# EAGLE design ID-12_breakout (EAGLE 5.11)
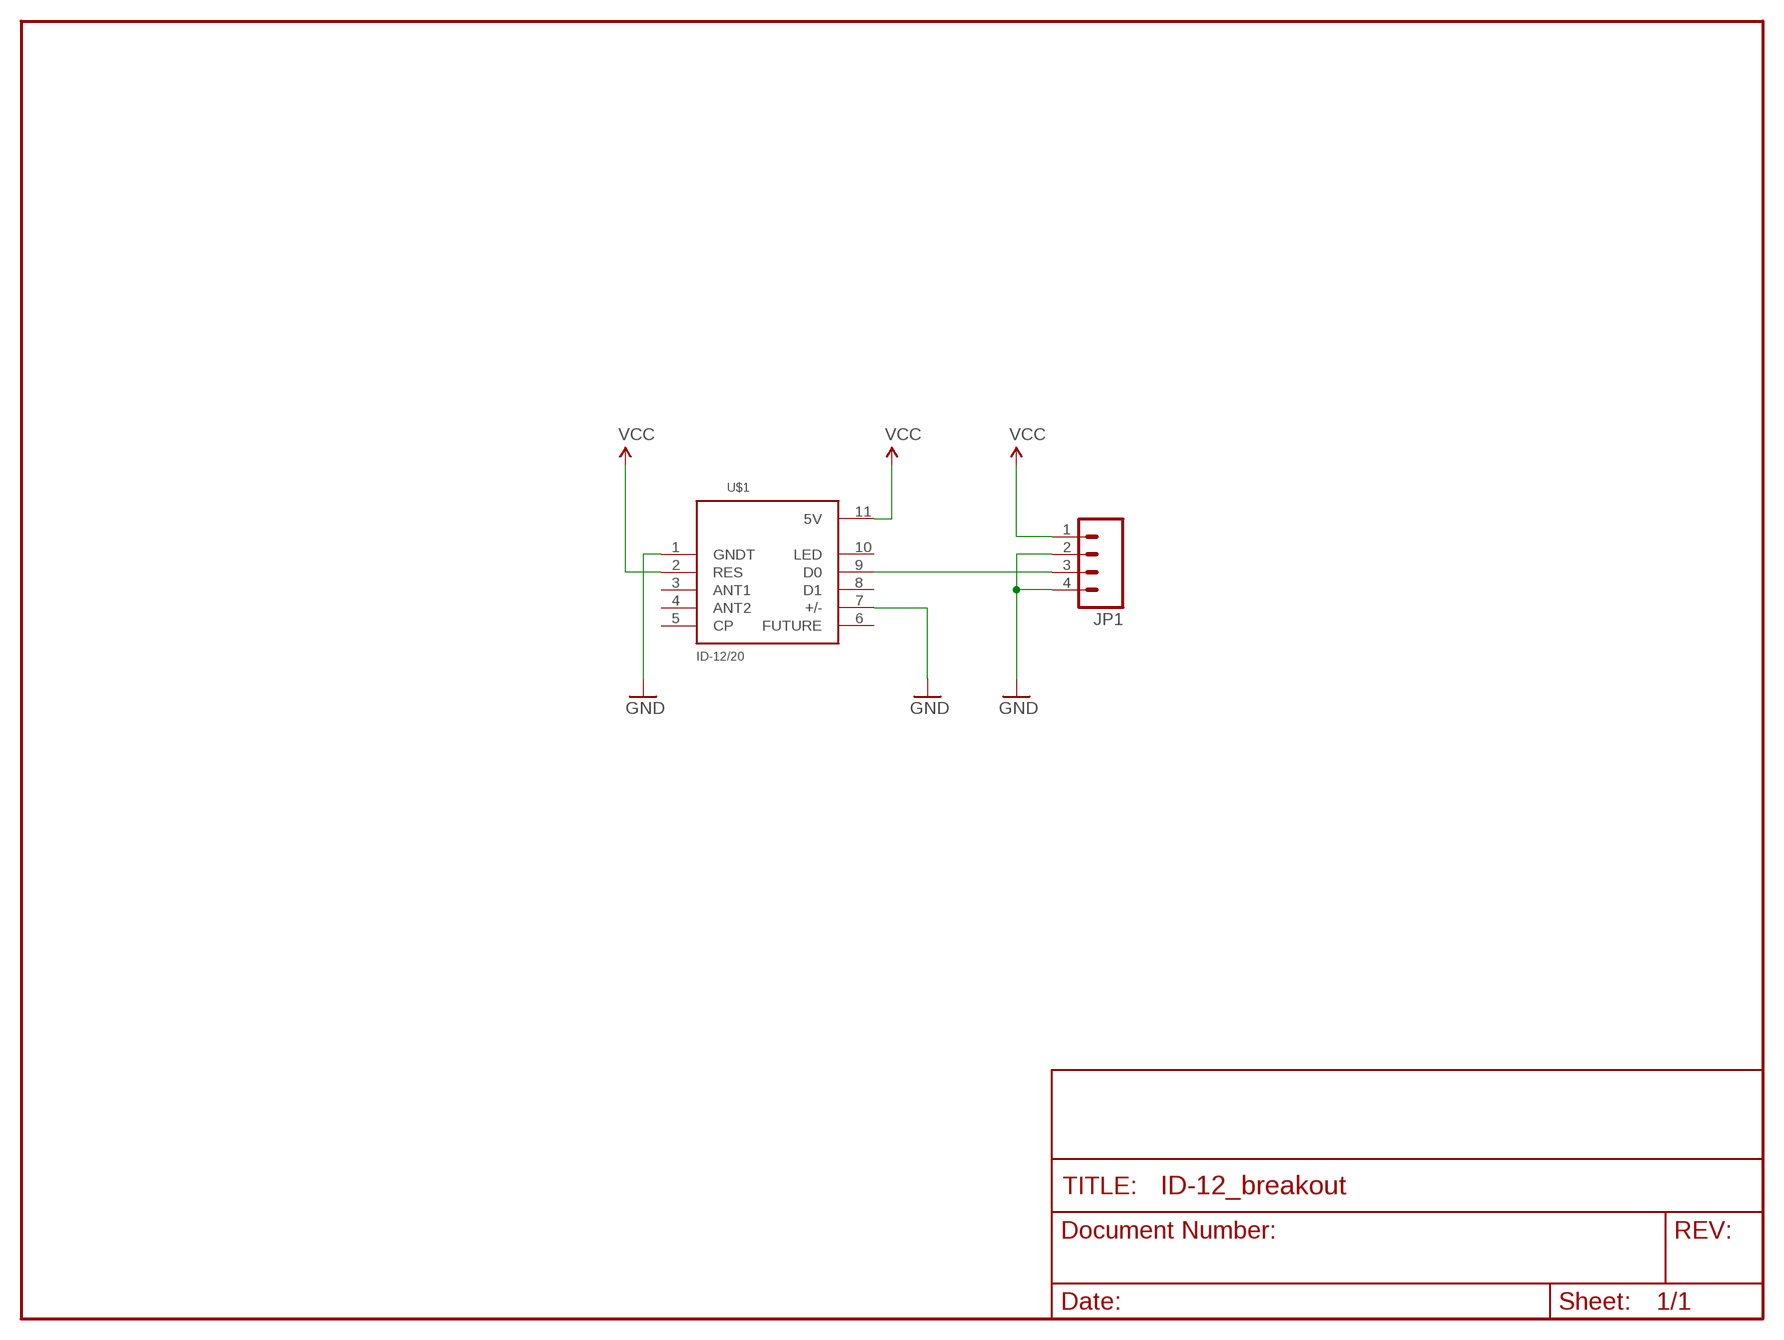
[diagram p0: schematic, sheet 1]

## Parts
JP1  M04PTH  [1X04]
U$1  ID-12/20  [ID-12]

## Nets
GND: JP1.2 JP1.4 U$1.1(GNDT) U$1.7(+/-)
N$9: JP1.3 U$1.9(D0)
VCC: JP1.1 U$1.2(RES) U$1.11(5V)
Unconnected: U$1.3(ANT1) U$1.4(ANT2) U$1.5(CP) U$1.6(FUTURE) U$1.8(D1) U$1.10(LED)

## Library data of the parts
JP1 = SparkFun:M04: Header 4 Standard 4-pin 0.1" header. Use with straight break away headers (SKU : PRT-00116), right angle break away headers (PRT-00553), swiss pins (PRT-00743), machine pins (PRT-00117), and female headers (PRT-00115). Molex polarized connector foot print use with SKU : PRT-08231 with associated crimp pins and housings. 1MM SMD Version SKU: PRT-10208
U$1 = SparkFun:ID-12/20: ID2, ID12, and ID20 Package

## Board
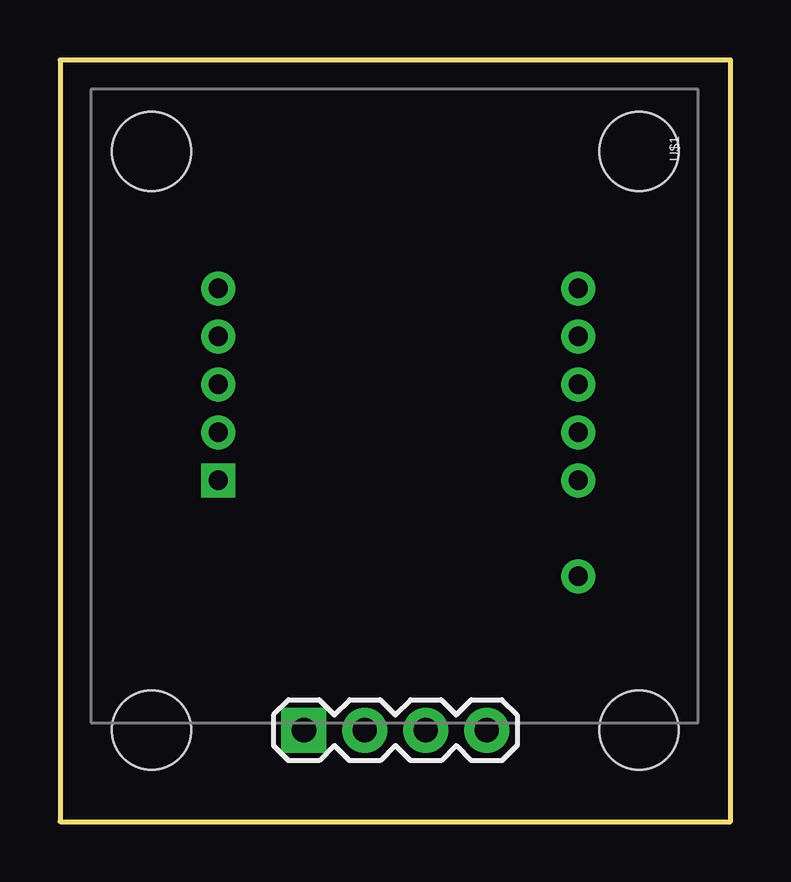
[diagram p1: board, top side]
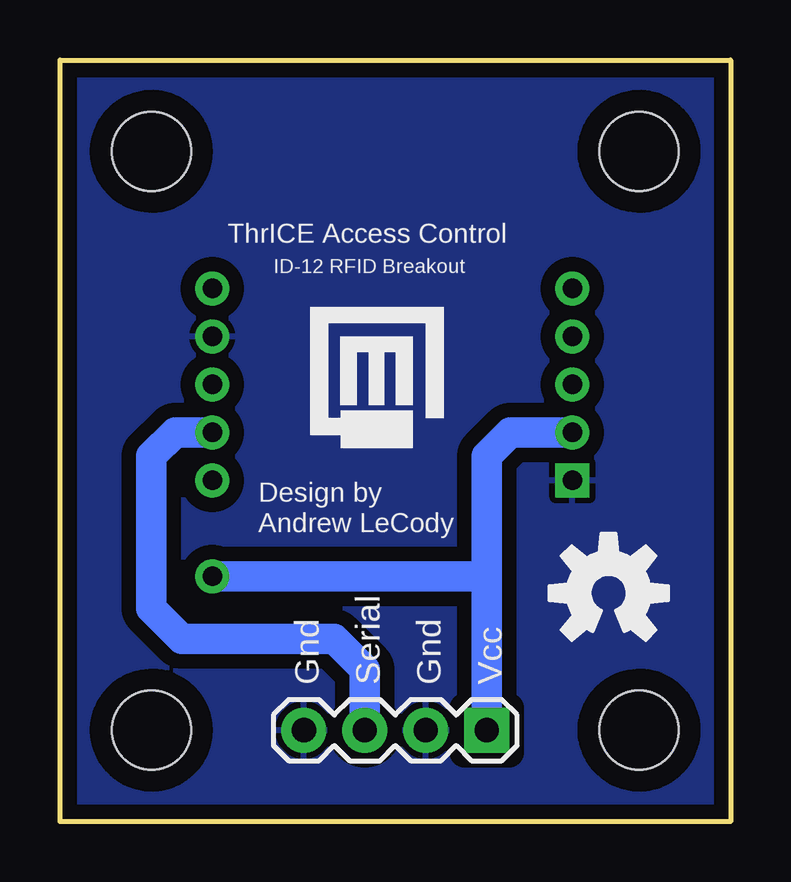
[diagram p2: board, bottom side, seen from below]

Size 27.94 x 31.75 mm. Coordinates in mm from the lower left corner, seen from the top.
Outline: 0,0 27.94,0 27.94,31.75 0,31.75 0,0
Copper layers (1*16): Top 0.035mm / dielectric 1.5mm / Bottom 0.035mm
Design rules "SparkFun": minimum track width 8mil, minimum drill 20mil, track to track 8mil, track to pad 8mil, pad to pad 8mil, via to via 8mil, smd to smd 8mil, copper to edge 10mil, drill to drill 8mil, minimum pad ring 12mil, minimum via ring 10mil, stop-mask expansion 4mil, vias tented up to drill 25mil, thermal gap 10mil

### Footprints (pad centres in the part's own frame; a part is rotated, then mirrored left to right if it is on the bottom)
1X04 = drill 1.016 pad 1.88 square: 1 0,0 | drill 1.016 pad 1.88 round: 2 2.54,0; 3 5.08,0; 4 7.62,0
ID-12 = drill 0.8 square: 1 16.255,5.32 | drill 0.8 round: 2 14.255,5.32; 3 12.255,5.32; 4 10.255,5.32; 5 8.255,5.32; 6 8.255,20.32; 7 10.255,20.32; 8 12.255,20.32; 9 14.255,20.32; 10 16.255,20.32; 11 20.255,20.32
STAND-OFF = hole 3.302: 0,0

### Placement (x,y rotation side)
E$2  [OSHW-LOGO-M]  5.08,9.53 0 bottom
JP1  10.16,3.81 0 top
U$1  1.27,30.48 270 top
U$2  [DMS-LOGO]  17.78,15.24 0 bottom
U$7  [STAND-OFF]  3.81,3.81 0 top
U$8  [STAND-OFF]  24.13,3.81 0 top
U$9  [STAND-OFF]  3.81,27.94 0 top
U$10  [STAND-OFF]  24.13,27.94 0 top

### Tracks (layer width: path | path; a pad name or v marks a point on that pad's centre or on a via)
GND
  pour Bottom (isolate 0.61): -2.54,-2.54 -2.54,34.29 30.48,34.29 30.48,-2.54
N$9
  Bottom 1.27: JP1.3 15.24,6.35 16.51,7.62 22.86,7.62 24.13,8.89 24.13,15.24 23.14,16.23 U$1.9
VCC
  Bottom 1.27: U$1.2 9.18,16.23 10.16,15.24 10.16,10.16 | JP1.1 10.16,10.16 | U$1.11 10.22,10.22 10.16,10.16

### Text on the board
bPlace: ThrICE Access Control | ID-12 RFID Breakout | Design by | Andrew LeCody | Vcc | Gnd | Serial | Gnd